# EAGLE design M627A (EAGLE 6.6.0)
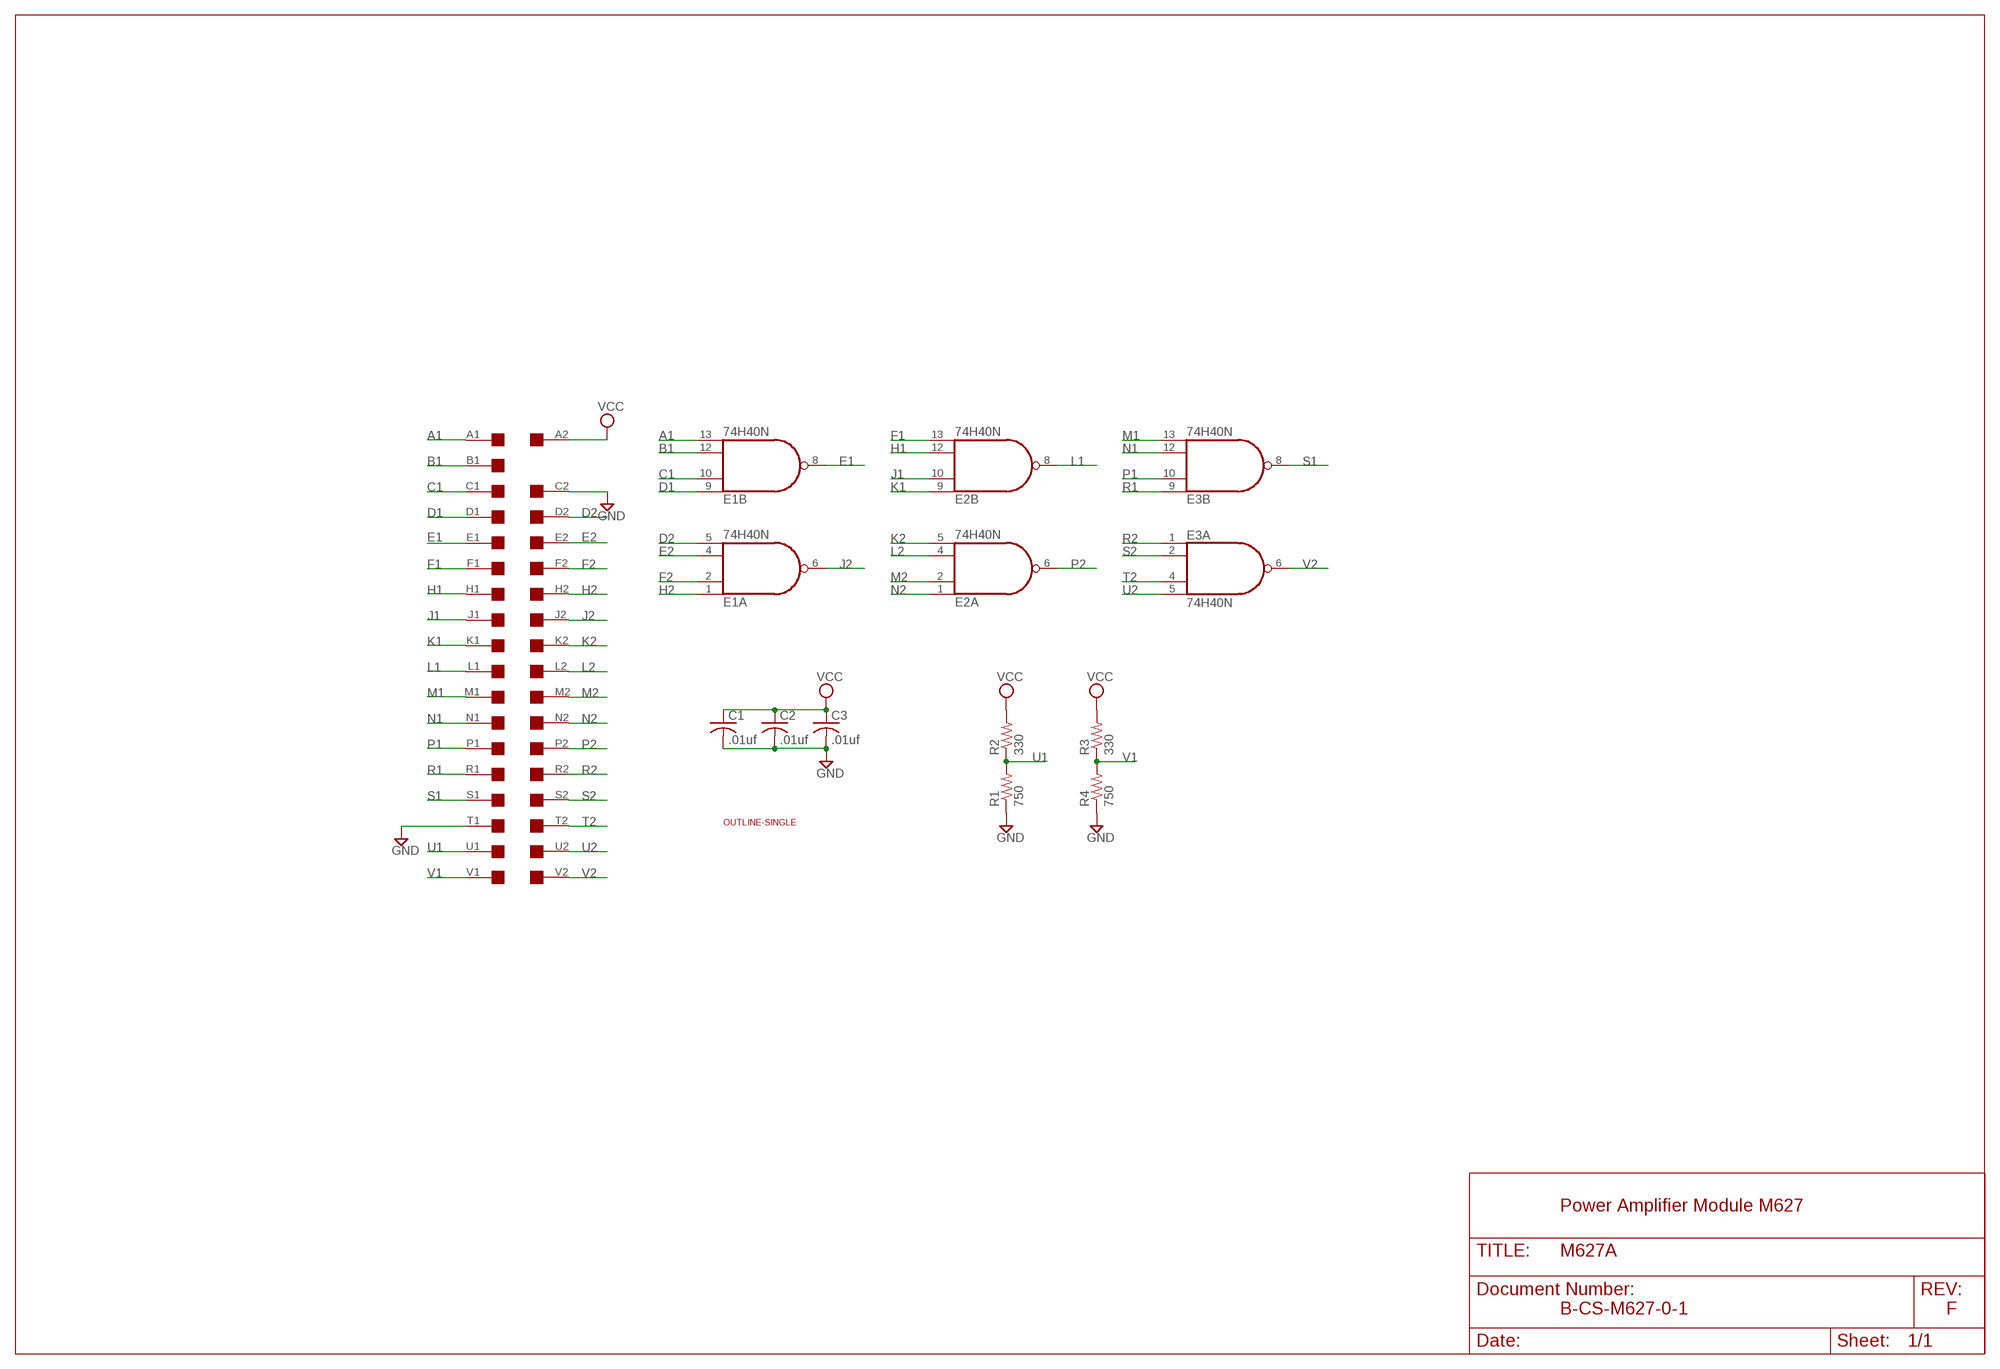
[diagram p0: schematic, sheet 1]

## Parts
C1  .01uf  C-US050-025X075  [C050-025X075]
C2  .01uf  C-US050-025X075  [C050-025X075]
C3  .01uf  C-US050-025X075  [C050-025X075]
E1  74H40N  74S20N  [DIL14]
E2  74H40N  74S20N  [DIL14]
E3  74H40N  74S20N  [DIL14]
R1  750  R-US_0207/10  [0207/10]
R2  330  R-US_0207/10  [0207/10]
R3  330  R-US_0207/10  [0207/10]
R4  750  R-US_0207/10  [0207/10]
U$1  OUTLINE-SINGLE  [SINGLE]
U$2  SINGLE  [EDGE-CON2]

## Nets
A1: E1.13(B:I3) U$2.A1
B1: E1.12(B:I2) U$2.B1
C1: E1.10(B:I1) U$2.C1
D1: E1.9(B:I0) U$2.D1
D2: E1.5(A:I3) U$2.D2
E1: E1.8(B:O) U$2.E1
E2: E1.4(A:I2) U$2.E2
F1: E2.13(B:I3) U$2.F1
F2: E1.2(A:I1) U$2.F2
GND: C1.2 C2.2 C3.2 R1.1 R4.1 U$2.C2 U$2.T1
H1: E2.12(B:I2) U$2.H1
H2: E1.1(A:I0) U$2.H2
J1: E2.10(B:I1) U$2.J1
J2: E1.6(A:O) U$2.J2
K1: E2.9(B:I0) U$2.K1
K2: E2.5(A:I3) U$2.K2
L1: E2.8(B:O) U$2.L1
L2: E2.4(A:I2) U$2.L2
M1: E3.13(B:I3) U$2.M1
M2: E2.2(A:I1) U$2.M2
N1: E3.12(B:I2) U$2.N1
N2: E2.1(A:I0) U$2.N2
P1: E3.10(B:I1) U$2.P1
P2: E2.6(A:O) U$2.P2
R1: E3.9(B:I0) U$2.R1
R2: E3.1(A:I0) U$2.R2
S1: E3.8(B:O) U$2.S1
S2: E3.2(A:I1) U$2.S2
T2: E3.4(A:I2) U$2.T2
U1: R1.2 R2.1 U$2.U1
U2: E3.5(A:I3) U$2.U2
V1: R3.1 R4.2 U$2.V1
V2: E3.6(A:O) U$2.V2
VCC: C1.1 C2.1 C3.1 R2.2 R3.2 U$2.A2
Unconnected: U$2.B2

## Notes on the sheet
- Power Amplifier Module M627
- B-CS-M627-0-1 | F

## Power pins joined to a net without a drawn wire
GND: E1.7(P:GND) E2.7(P:GND) E3.7(P:GND)
VCC: E1.14(P:VCC) E2.14(P:VCC) E3.14(P:VCC)

## Library data of the parts
C1-C3 = rcl:C-US: CAPACITOR, American symbol
E1-E3 = 74xx-us:74*20: Dual 4-input NAND gate
R1-R4 = rcl:R-US_: RESISTOR, American symbol
U$1 = dec-con:OUTLINE-*: Board outlines for DEC boards.
U$2 = dec-con:SINGLE: Single-Height DEC board

## Board
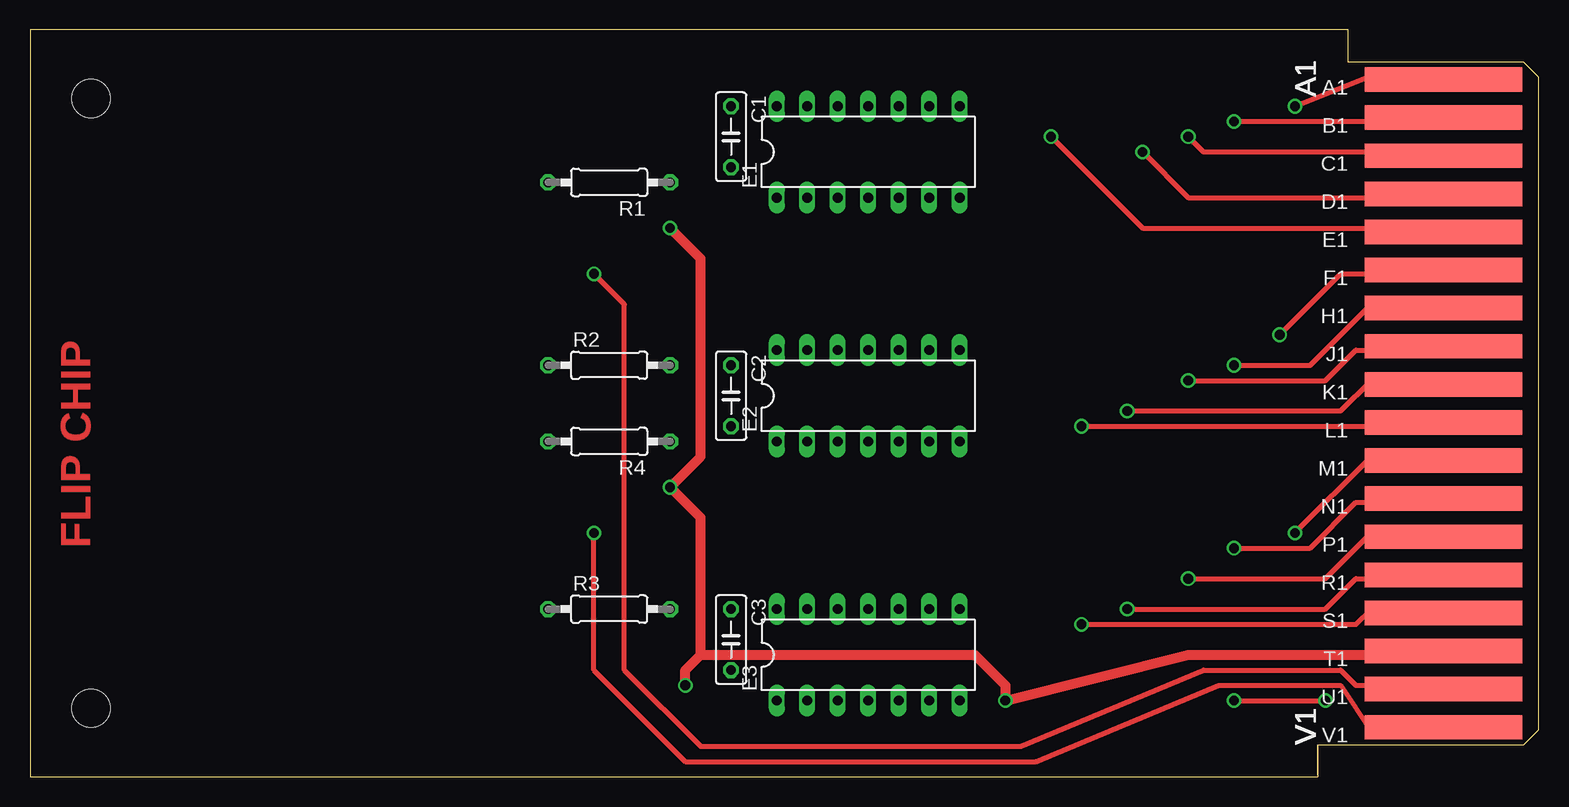
[diagram p1: board, top side]
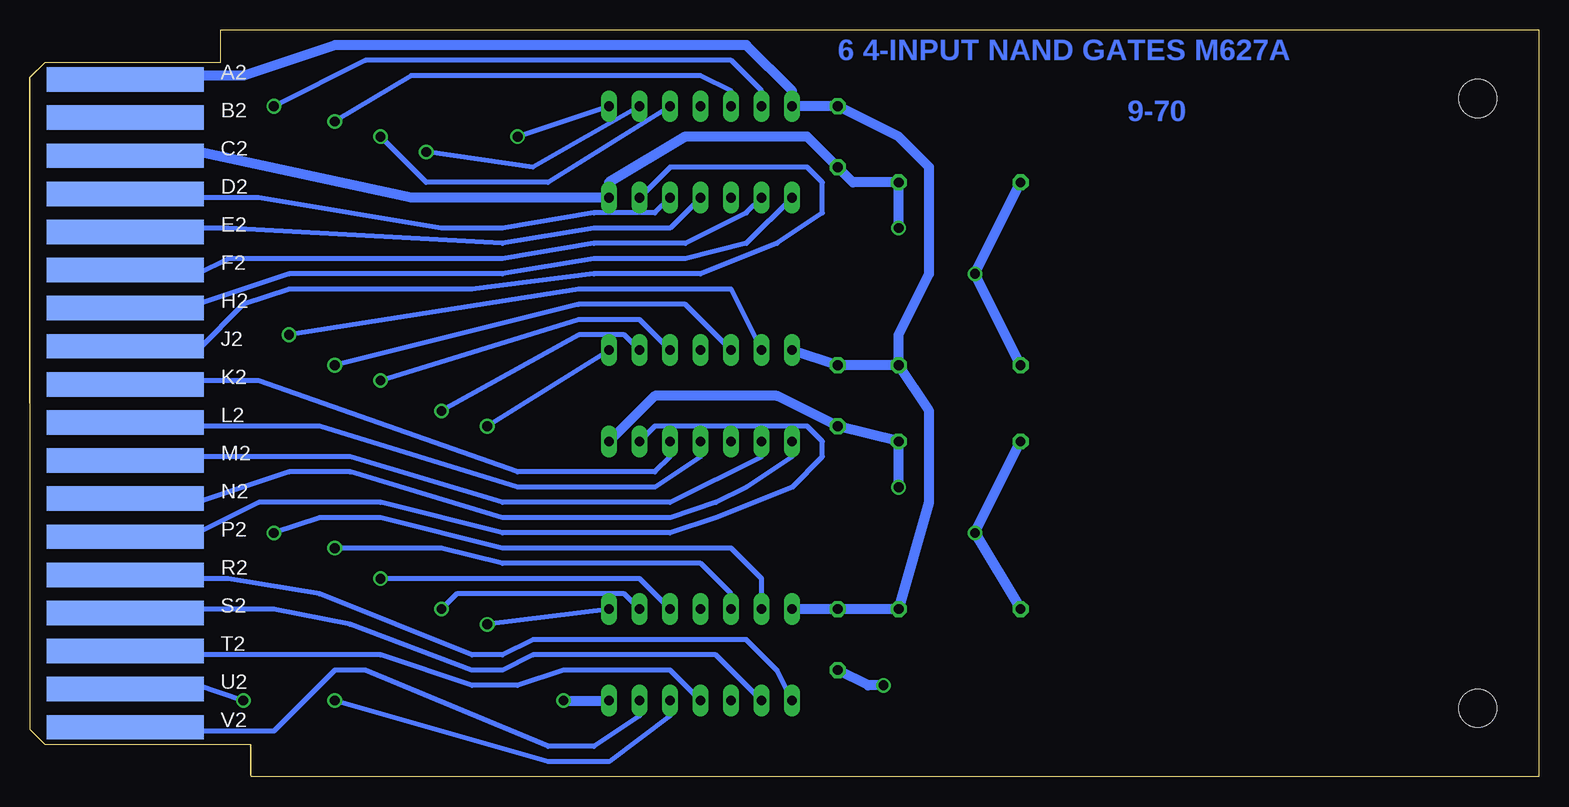
[diagram p2: board, bottom side, seen from below]

Size 125.73 x 62.23 mm. Coordinates in mm from the lower left corner, seen from the top.
Copper layers (1+16): Top 0.035mm / dielectric 1.5mm / Bottom 0.035mm
Design rules "16mils": minimum track width 16mil, minimum drill 32mil, track to track 15mil, track to pad 10mil, pad to pad 10mil, via to via 10mil, smd to smd 10mil, copper to edge 13mil, drill to drill 10mil, minimum pad ring 10mil, minimum via ring 8mil, stop-mask expansion 0mil, vias tented up to drill 0mil, thermal gap 10mil

### Footprints (pad centres in the part's own frame; a part is rotated, then mirrored left to right if it is on the bottom)
C050-025X075 = drill 0.813 octagon: 1 -2.54,0; 2 2.54,0
DIL14 = drill 0.813 long: 1 -7.62,-3.81; 2 -5.08,-3.81; 3 -2.54,-3.81; 4 0,-3.81; 5 2.54,-3.81; 6 5.08,-3.81; 7 7.62,-3.81; 8 7.62,3.81; 9 5.08,3.81; 10 2.54,3.81; 11 0,3.81; 12 -2.54,3.81; 13 -5.08,3.81; 14 -7.62,3.81
0207/10 = drill 0.813 octagon: 1 -5.08,0; 2 5.08,0
SINGLE = hole 3.175: 120.65,56.515; 120.65,5.715
EDGE-CON2 = smd 13.106 x 2.032: A1 7.938,4.128; B1 7.938,7.303; C1 7.938,10.477; D1 7.938,13.652; E1 7.938,16.828; F1 7.938,20.003; H1 7.938,23.177; J1 7.938,26.352; K1 7.938,29.527; L1 7.938,32.703; M1 7.938,35.877; N1 7.938,39.053; P1 7.938,42.227; R1 7.938,45.403; S1 7.938,48.578; T1 7.938,51.752; U1 7.938,54.928; V1 7.938,58.102 | smd 13.106 x 2.032 bottom: A2 7.938,4.128; B2 7.938,7.303; C2 7.938,10.477; D2 7.938,13.652; E2 7.938,16.828; F2 7.938,20.003; H2 7.938,23.177; J2 7.938,26.352; K2 7.938,29.527; L2 7.938,32.703; M2 7.938,35.877; N2 7.938,39.053; P2 7.938,42.227; R2 7.938,45.403; S2 7.938,48.578; T2 7.938,51.752; U2 7.938,54.928; V2 7.938,58.102

### Placement (x,y rotation side)
C1  58.42,53.34 270 top
C2  58.42,31.75 270 top
C3  58.42,11.43 270 top
E1  69.85,52.07 0 top
E2  69.85,31.75 0 top
E3  69.85,10.16 0 top
R1  48.26,49.53 180 top
R2  48.26,34.29 0 top
R3  48.26,13.97 0 top
R4  48.26,27.94 180 top
U$1  125.73,62.23 180 top
U$2  125.73,62.23 180 top
U$3  [FLIPCHIP]  0,0 0 top

### Tracks (layer width: path | path; a pad name or v marks a point on that pad's centre or on a via)
A1  (via drill 0.81)
  Top 0.406: U$2.A1 116.84,58.42 111.76,58.42 v105.41,55.88
  Bottom 0.406: E1.13 64.77,57.15 67.31,59.69 97.79,59.69 v105.41,55.88
B1  (via drill 0.81)
  Top 0.406: U$2.B1 116.84,54.61 v100.33,54.61
  Bottom 0.406: E1.12 67.31,57.15 69.85,58.42 93.98,58.42 v100.33,54.61
C1  (via drill 0.81)
  Top 0.406: U$2.C1 116.84,52.07 97.79,52.07 v96.52,53.34
  Bottom 0.406: E1.10 82.55,49.53 92.71,49.53 v96.52,53.34
D1  (via drill 0.81)
  Top 0.406: U$2.D1 116.84,48.26 96.52,48.26 v92.71,52.07
  Bottom 0.406: E1.9 83.82,50.8 v92.71,52.07
D2
  Bottom 0.406: E1.5 73.66,46.99 78.74,46.99 86.36,45.72 91.44,45.72 106.68,48.26 116.84,48.26 U$2.D2
E1  (via drill 0.81)
  Top 0.406: U$2.E1 116.84,45.72 92.71,45.72 v85.09,53.34
  Bottom 0.406: E1.8 v85.09,53.34
E2
  Bottom 0.406: E1.4 72.39,45.72 78.74,45.72 86.36,44.45 109.22,45.72 116.84,45.72 U$2.E2
F1  (via drill 0.81)
  Top 0.406: U$2.F1 116.84,41.91 109.22,41.91 v104.14,36.83
  Bottom 0.406: E2.13 67.31,40.64 80.01,40.64 v104.14,36.83
F2
  Bottom 0.406: E1.2 66.04,46.99 71.12,44.45 78.74,44.45 86.36,43.18 109.22,43.18 111.76,41.91 116.84,41.91 U$2.F2
GND  (via drill 0.81)
  Top 0.813: 55.88,10.16 78.74,10.16 81.28,7.62 v81.28,6.35 96.52,10.16 116.84,10.16 U$2.T1 | 55.88,10.16 54.61,8.89 v54.61,7.62 | v53.34,45.72 55.88,43.18 55.88,26.67 v53.34,24.13 55.88,21.59 55.88,10.16
  Bottom 0.813: E2.7 73.66,31.75 63.5,31.75 C2.2 R4.1 v53.34,24.13 | v81.28,6.35 E3.7 | v54.61,7.62 55.88,7.62 C3.2 | v53.34,45.72 R1.1 57.15,49.53 C1.2 60.96,53.34 71.12,53.34 77.47,49.53 E1.7 93.98,48.26 111.76,52.07 116.84,52.07 U$2.C2
H1  (via drill 0.81)
  Top 0.406: U$2.H1 116.84,39.37 111.76,39.37 106.68,34.29 v100.33,34.29
  Bottom 0.406: E2.12 71.12,39.37 80.01,39.37 v100.33,34.29
H2
  Bottom 0.406: E1.1 66.04,44.45 71.12,43.18 78.74,43.18 86.36,41.91 104.14,41.91 111.76,39.37 116.84,39.37 U$2.H2
J1  (via drill 0.81)
  Top 0.406: U$2.J1 116.84,35.56 110.49,35.56 107.95,33.02 v96.52,33.02
  Bottom 0.406: E2.10 74.93,38.1 80.01,38.1 v96.52,33.02
J2
  Bottom 0.406: E1.6 72.39,50.8 60.96,50.8 59.69,49.53 59.69,46.99 63.5,44.45 69.85,41.91 78.74,41.91 88.9,40.64 104.14,40.64 107.95,39.37 111.76,35.56 116.84,35.56 U$2.J2
K1  (via drill 0.81)
  Top 0.406: U$2.K1 116.84,33.02 111.76,33.02 109.22,30.48 v91.44,30.48
  Bottom 0.406: E2.9 76.2,36.83 80.01,36.83 v91.44,30.48
K2
  Bottom 0.406: E2.5 72.39,26.67 73.66,25.4 85.09,25.4 106.68,33.02 116.84,33.02 U$2.K2
L1  (via drill 0.81)
  Top 0.406: U$2.L1 116.84,29.21 v87.63,29.21
  Bottom 0.406: E2.8 v87.63,29.21
L2
  Bottom 0.406: E2.4 69.85,26.67 73.66,24.13 85.09,24.13 101.6,29.21 115.57,29.21 U$2.L2
M1  (via drill 0.81)
  Top 0.406: U$2.M1 116.84,26.67 111.76,26.67 v105.41,20.32
  Bottom 0.406: E3.13 64.77,16.51 67.31,19.05 86.36,19.05 96.52,21.59 101.6,21.59 v105.41,20.32
M2
  Bottom 0.406: E2.2 64.77,26.67 72.39,22.86 86.36,22.86 99.06,26.67 116.84,26.67 U$2.M2
N1  (via drill 0.81)
  Top 0.406: U$2.N1 116.84,22.86 110.49,22.86 106.68,19.05 v100.33,19.05
  Bottom 0.406: E3.12 67.31,15.24 69.85,17.78 86.36,17.78 91.44,19.05 v100.33,19.05
N2
  Bottom 0.406: E2.1 62.23,26.67 66.04,24.13 68.58,22.86 72.39,21.59 86.36,21.59 99.06,25.4 104.14,25.4 111.76,22.86 116.84,22.86 U$2.N2
P1  (via drill 0.81)
  Top 0.406: U$2.P1 116.84,20.32 111.76,20.32 107.95,16.51 v96.52,16.51
  Bottom 0.406: E3.10 74.93,16.51 v96.52,16.51
P2
  Bottom 0.406: E2.6 73.66,29.21 60.96,29.21 59.69,27.94 59.69,26.67 62.23,24.13 68.58,21.59 72.39,20.32 86.36,20.32 96.52,22.86 106.68,22.86 111.76,20.32 116.84,20.32 U$2.P2
R1  (via drill 0.81)
  Top 0.406: U$2.R1 116.84,16.51 110.49,16.51 107.95,13.97 v91.44,13.97
  Bottom 0.406: E3.9 76.2,15.24 90.17,15.24 v91.44,13.97
R2
  Bottom 0.406: E3.1 63.5,8.89 66.04,11.43 83.82,11.43 86.36,10.16 88.9,10.16 101.6,15.24 109.22,16.51 116.84,16.51 U$2.R2
S1  (via drill 0.81)
  Top 0.406: U$2.S1 116.84,13.97 111.76,13.97 110.49,12.7 v87.63,12.7
  Bottom 0.406: E3.8 v87.63,12.7
S2
  Bottom 0.406: E3.2 68.58,10.16 83.82,10.16 86.36,8.89 88.9,8.89 99.06,12.7 105.41,13.97 116.84,13.97 U$2.S2
T2
  Bottom 0.406: E3.4 72.39,8.89 81.28,8.89 85.09,7.62 88.9,7.62 96.52,10.16 116.84,10.16 U$2.T2
U1  (via drill 0.81)
  Top 0.406: U$2.U1 116.84,7.62 110.49,7.62 109.22,8.89 97.79,8.89 82.55,2.54 55.88,2.54 49.53,8.89 49.53,39.37 v46.99,41.91
  Bottom 0.813: R1.2 v46.99,41.91 R2.1
U2  (via drill 0.81)
  Top 0.406: v100.33,6.35 v107.95,6.35
  Bottom 0.406: E3.5 72.39,5.08 77.47,1.27 82.55,1.27 v100.33,6.35 | U$2.U2 116.84,7.62 111.76,7.62 v107.95,6.35
V1  (via drill 0.81)
  Top 0.406: U$2.V1 116.84,3.81 111.76,3.81 109.22,7.62 99.06,7.62 83.82,1.27 54.61,1.27 46.99,8.89 v46.99,20.32
  Bottom 0.813: R3.1 v46.99,20.32 R4.2
V2
  Bottom 0.406: U$2.V2 117.23,4.2 116.84,3.81 105.41,3.81 100.33,8.89 97.79,8.89 82.55,2.54 78.74,2.54 74.93,5.08 E3.6
VCC
  Bottom 0.813: E3.14 C3.1 R3.2 50.8,22.86 50.8,30.48 R2.2 | R2.2 C2.1 E2.14 | U$2.A2 116.84,58.42 107.95,58.42 100.33,60.96 66.04,60.96 62.23,57.15 E1.14 C1.1 53.34,53.34 50.8,50.8 50.8,41.91 53.34,36.83 R2.2

### Text on the board
Bottom: 6 4-INPUT NAND GATES M627A | 9-70
tNames: A1 | A1 | A1 | A1 | A1 | A1 | A1 | A1 | A1 | A1 | A1 | A1 | A1 | A1 | A1 | A1 | A1 | A1 | A1 | A1 | A1 | A1 | A1 | A1 | A1 | A1 | A1 | A1 | A1 | A1 | A1 | A1 | V1 | V1 | V1 | V1 | V1 | V1 | V1 | V1 | V1 | V1 | V1 | V1 | V1 | V1 | V1 | V1 | V1 | V1 | V1 | V1 | V1 | V1 | V1 | V1 | V1 | V1 | V1 | V1 | V1 | V1 | V1 | V1